# Altium schematic sheet S7CAS-PLEIADES-CARTE-MERE_P06_FPGA3.SCHDOC
size Tabloid; SheetNumber: 8; SheetTotal: 18; Sheet_Name: FPGA3; Size: 11x17
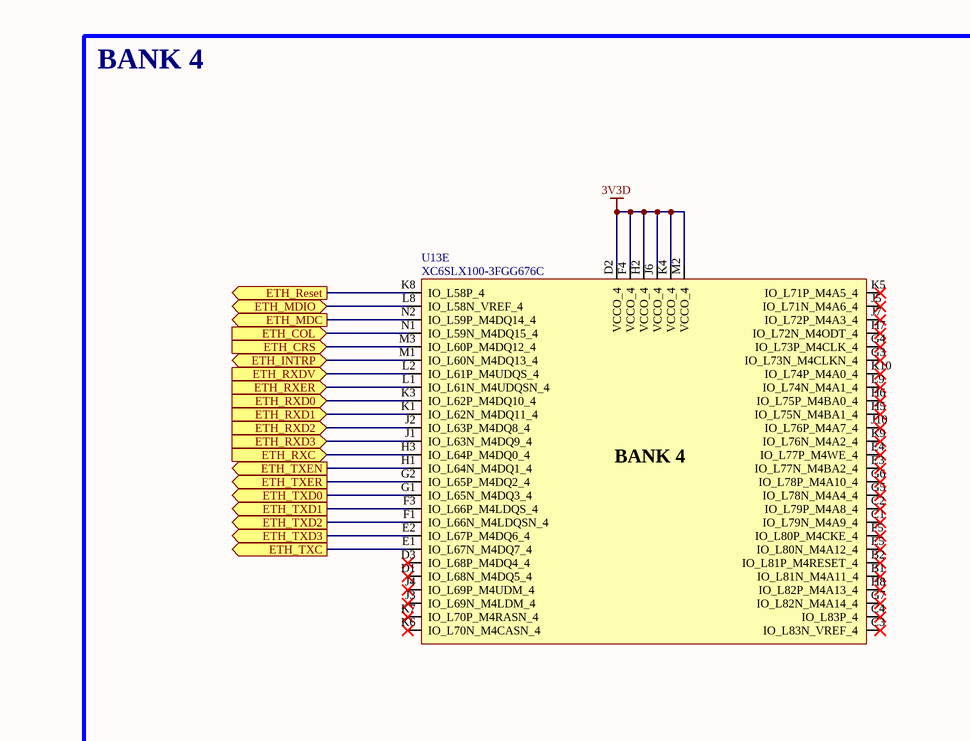
[diagram p0: S7CAS-PLEIADES-CARTE-MERE_P06_FPGA3.SCHDOC, top left]
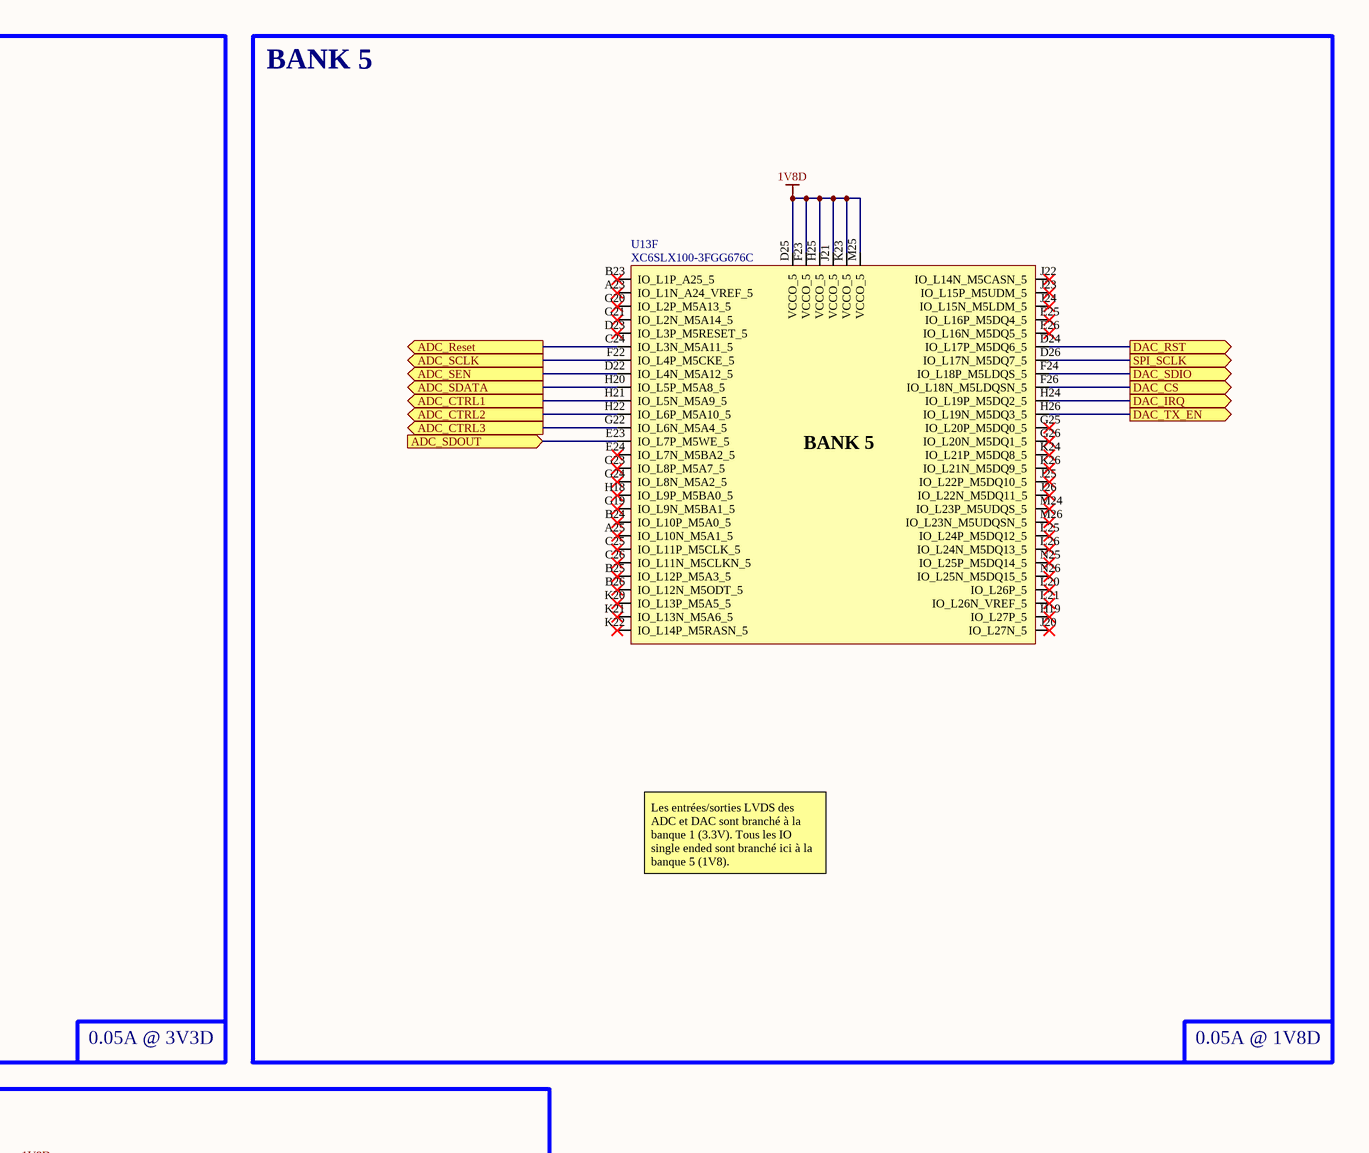
[diagram p1: S7CAS-PLEIADES-CARTE-MERE_P06_FPGA3.SCHDOC, top right]
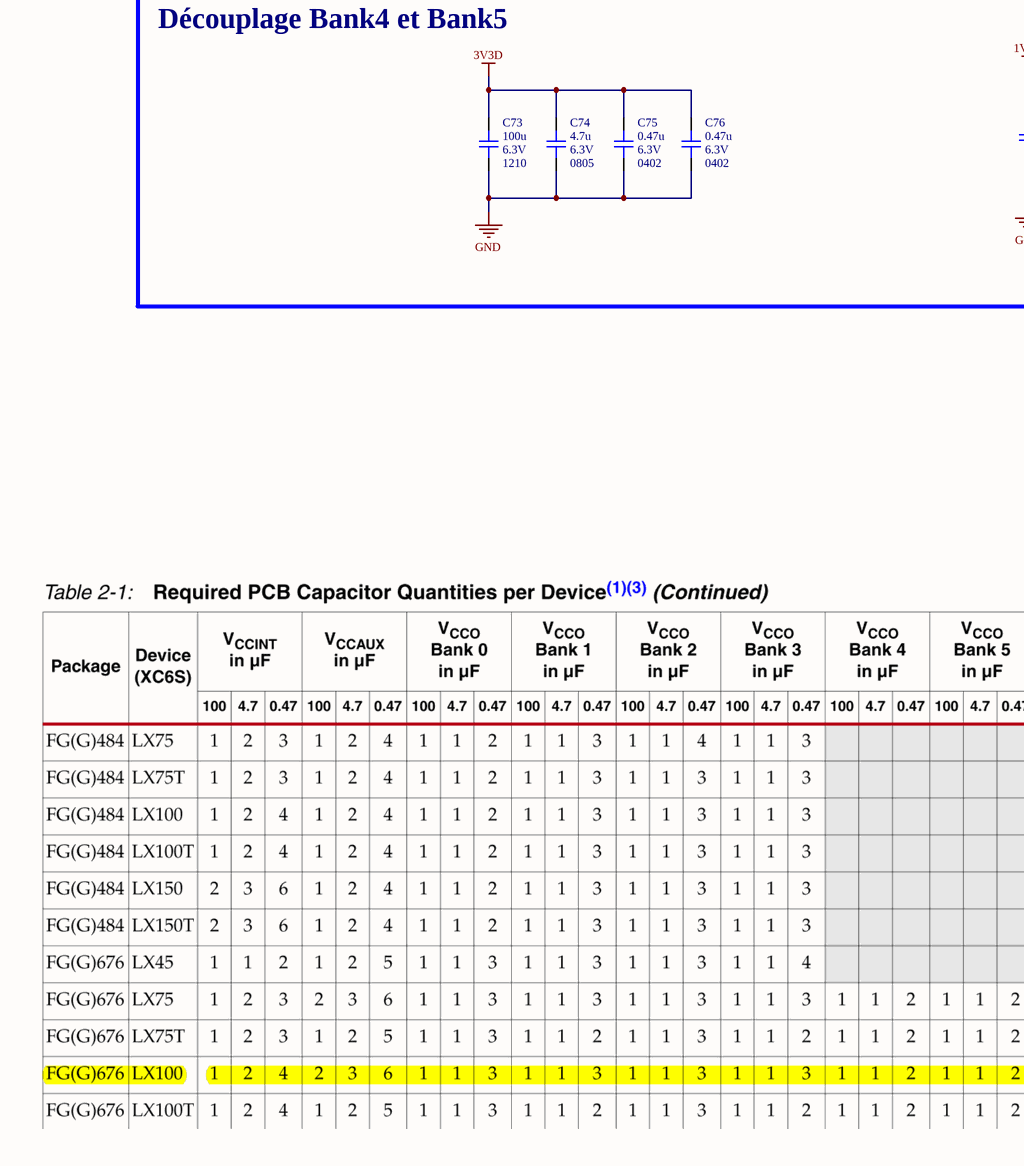
[diagram p2: S7CAS-PLEIADES-CARTE-MERE_P06_FPGA3.SCHDOC, bottom left]
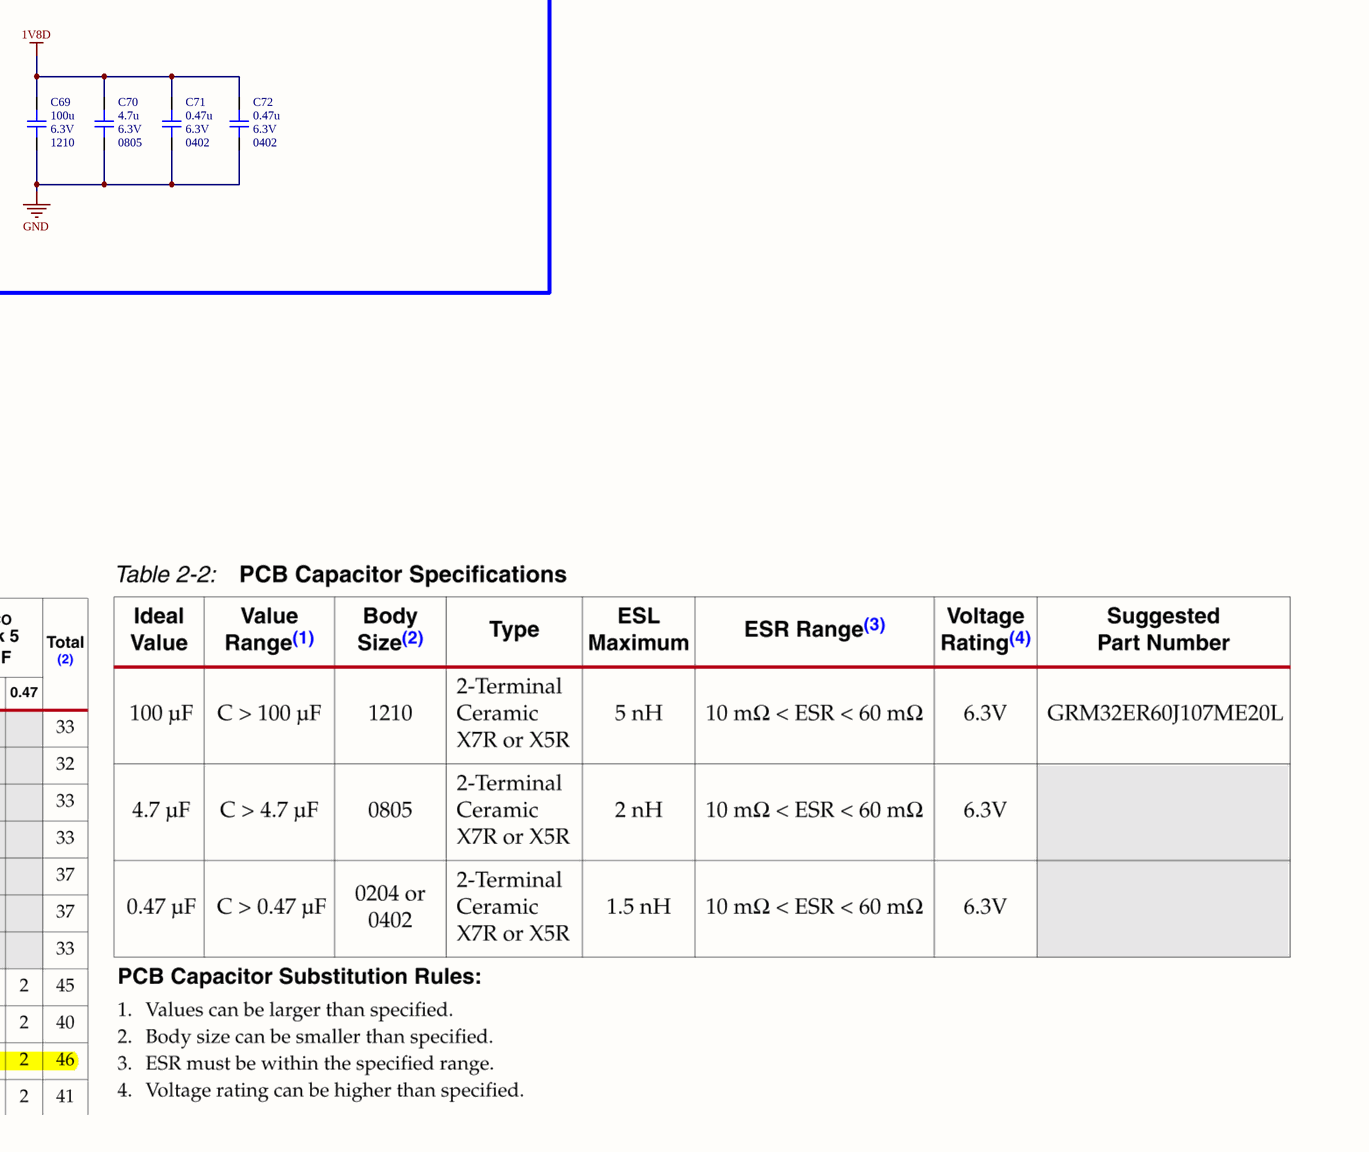
[diagram p3: S7CAS-PLEIADES-CARTE-MERE_P06_FPGA3.SCHDOC, bottom right]

## Parts
C69  value 100u  Voltage: 6.3V  Package: 1210  [CAP_1210]  (hidden comment: CAP - 1210)
C70  value 4.7u  Voltage: 6.3V  Package: 0805  [CAP_0805]  (hidden comment: CAP - 0805)
C71  value 0.47u  Voltage: 6.3V  Package: 0402  [CAP_0402]  (hidden comment: CAP - 0402)
C72  value 0.47u  Voltage: 6.3V  Package: 0402  [CAP_0402]  (hidden comment: CAP - 0402)
C73  value 100u  Voltage: 6.3V  Package: 1210  [CAP_1210]  (hidden comment: CAP - 1210)
C74  value 4.7u  Voltage: 6.3V  Package: 0805  [CAP_0805]  (hidden comment: CAP - 0805)
C75  value 0.47u  Voltage: 6.3V  Package: 0402  [CAP_0402]  (hidden comment: CAP - 0402)
C76  value 0.47u  Voltage: 6.3V  Package: 0402  [CAP_0402]  (hidden comment: CAP - 0402)
U13  XC6SLX100-3FGG676C  [FPGA_XILINX_FGG676]  (parts E,F of 10)

## Blocks framed on the sheet
BANK 4: U13
BANK 5: U13
Découplage Bank4 et Bank5: C69-C76

## Ports
ADC_CTRL1 (out, see S7CAS-PLEIADES-CARTE-MERE_P06_ADC[5A]), ADC_CTRL2 (out, see S7CAS-PLEIADES-CARTE-MERE_P06_ADC[5A]), ADC_CTRL3 (out, see S7CAS-PLEIADES-CARTE-MERE_P06_ADC[5A]), ADC_Reset (out, see S7CAS-PLEIADES-CARTE-MERE_P06_ADC[5A]), ADC_SCLK (out, see S7CAS-PLEIADES-CARTE-MERE_P06_ADC[5A]), ADC_SDATA (out, see S7CAS-PLEIADES-CARTE-MERE_P06_ADC[5A]), ADC_SDOUT (in, see S7CAS-PLEIADES-CARTE-MERE_P06_ADC[6A]), ADC_SEN (out, see S7CAS-PLEIADES-CARTE-MERE_P06_ADC[5A]), DAC_CS (out, see S7CAS-PLEIADES-CARTE-MERE_P06_DAC[5A]), DAC_IRQ (out, see S7CAS-PLEIADES-CARTE-MERE_P06_DAC[5A]), DAC_RST (out, see S7CAS-PLEIADES-CARTE-MERE_P06_DAC[5A]), DAC_SDIO (out, see S7CAS-PLEIADES-CARTE-MERE_P06_DAC[5A]), DAC_TX_EN (out, see S7CAS-PLEIADES-CARTE-MERE_P06_DAC[5B]), ETH_COL (in, see S7CAS-PLEIADES-CARTE-MERE_P06_ETHERNET[2B]), ETH_CRS (in, see S7CAS-PLEIADES-CARTE-MERE_P06_ETHERNET[2B]), ETH_INTRP (bidir, see S7CAS-PLEIADES-CARTE-MERE_P06_ETHERNET[1B]), ETH_MDC (out, see S7CAS-PLEIADES-CARTE-MERE_P06_ETHERNET[2A]), ETH_MDIO (bidir, see S7CAS-PLEIADES-CARTE-MERE_P06_ETHERNET[1A]), ETH_Reset (out, see S7CAS-PLEIADES-CARTE-MERE_P06_ETHERNET[2A]), ETH_RXC (in, see S7CAS-PLEIADES-CARTE-MERE_P06_ETHERNET[2B]), ETH_RXD0 (in, see S7CAS-PLEIADES-CARTE-MERE_P06_ETHERNET[2B]), ETH_RXD1 (in, see S7CAS-PLEIADES-CARTE-MERE_P06_ETHERNET[2B]), ETH_RXD2 (in, see S7CAS-PLEIADES-CARTE-MERE_P06_ETHERNET[2B]), ETH_RXD3 (in, see S7CAS-PLEIADES-CARTE-MERE_P06_ETHERNET[2B]), ETH_RXDV (in, see S7CAS-PLEIADES-CARTE-MERE_P06_ETHERNET[2B]), ETH_RXER (in, see S7CAS-PLEIADES-CARTE-MERE_P06_ETHERNET[2B]), ETH_TXC (out, see S7CAS-PLEIADES-CARTE-MERE_P06_ETHERNET[2B]), ETH_TXD0 (out, see S7CAS-PLEIADES-CARTE-MERE_P06_ETHERNET[2B]), ETH_TXD1 (out, see S7CAS-PLEIADES-CARTE-MERE_P06_ETHERNET[2B]), ETH_TXD2 (out, see S7CAS-PLEIADES-CARTE-MERE_P06_ETHERNET[2B]), ETH_TXD3 (out, see S7CAS-PLEIADES-CARTE-MERE_P06_ETHERNET[2B]), ETH_TXEN (out, see S7CAS-PLEIADES-CARTE-MERE_P06_ETHERNET[2B]), ETH_TXER (out, see S7CAS-PLEIADES-CARTE-MERE_P06_ETHERNET[2B]), SPI_SCLK (out, see S7CAS-PLEIADES-CARTE-MERE_P06_DAC[5A])

## Nets
1V8D: C69.2 C70.2 C71.2 C72.2 U13.D25(VCCO_5) U13.F23(VCCO_5) U13.H25(VCCO_5) U13.J21(VCCO_5) U13.K23(VCCO_5) U13.M25(VCCO_5)
3V3D: C73.2 C74.2 C75.2 C76.2 U13.D2(VCCO_4) U13.F4(VCCO_4) U13.H2(VCCO_4) U13.J6(VCCO_4) U13.K4(VCCO_4) U13.M2(VCCO_4)
GND: C69.1 C70.1 C71.1 C72.1 C73.1 C74.1 C75.1 C76.1
ADC_CTRL1: U13.H21(IO_L5N_M5A9_5) ; port ADC_CTRL1
ADC_CTRL2: U13.H22(IO_L6P_M5A10_5) ; port ADC_CTRL2
ADC_CTRL3: U13.G22(IO_L6N_M5A4_5) ; port ADC_CTRL3
ADC_Reset: U13.C24(IO_L3N_M5A11_5) ; port ADC_Reset
ADC_SCLK: U13.F22(IO_L4P_M5CKE_5) ; port ADC_SCLK
ADC_SDATA: U13.H20(IO_L5P_M5A8_5) ; port ADC_SDATA
ADC_SDOUT: U13.E23(IO_L7P_M5WE_5) ; port ADC_SDOUT
ADC_SEN: U13.D22(IO_L4N_M5A12_5) ; port ADC_SEN
DAC_CS: U13.F26(IO_L18N_M5LDQSN_5) ; port DAC_CS
DAC_IRQ: U13.H24(IO_L19P_M5DQ2_5) ; port DAC_IRQ
DAC_RST: U13.D24(IO_L17P_M5DQ6_5) ; port DAC_RST
DAC_SDIO: U13.F24(IO_L18P_M5LDQS_5) ; port DAC_SDIO
DAC_TX_EN: U13.H26(IO_L19N_M5DQ3_5) ; port DAC_TX_EN
ETH_COL: U13.N1(IO_L59N_M4DQ15_4) ; port ETH_COL
ETH_CRS: U13.M3(IO_L60P_M4DQ12_4) ; port ETH_CRS
ETH_INTRP: U13.M1(IO_L60N_M4DQ13_4) ; port ETH_INTRP
ETH_MDC: U13.N2(IO_L59P_M4DQ14_4) ; port ETH_MDC
ETH_MDIO: U13.L8(IO_L58N_VREF_4) ; port ETH_MDIO
ETH_Reset: U13.K8(IO_L58P_4) ; port ETH_Reset
ETH_RXC: U13.H3(IO_L64P_M4DQ0_4) ; port ETH_RXC
ETH_RXD0: U13.K3(IO_L62P_M4DQ10_4) ; port ETH_RXD0
ETH_RXD1: U13.K1(IO_L62N_M4DQ11_4) ; port ETH_RXD1
ETH_RXD2: U13.J2(IO_L63P_M4DQ8_4) ; port ETH_RXD2
ETH_RXD3: U13.J1(IO_L63N_M4DQ9_4) ; port ETH_RXD3
ETH_RXDV: U13.L2(IO_L61P_M4UDQS_4) ; port ETH_RXDV
ETH_RXER: U13.L1(IO_L61N_M4UDQSN_4) ; port ETH_RXER
ETH_TXC: U13.E1(IO_L67N_M4DQ7_4) ; port ETH_TXC
ETH_TXD0: U13.G1(IO_L65N_M4DQ3_4) ; port ETH_TXD0
ETH_TXD1: U13.F3(IO_L66P_M4LDQS_4) ; port ETH_TXD1
ETH_TXD2: U13.F1(IO_L66N_M4LDQSN_4) ; port ETH_TXD2
ETH_TXD3: U13.E2(IO_L67P_M4DQ6_4) ; port ETH_TXD3
ETH_TXEN: U13.H1(IO_L64N_M4DQ1_4) ; port ETH_TXEN
ETH_TXER: U13.G2(IO_L65P_M4DQ2_4) ; port ETH_TXER
SPI_SCLK: U13.D26(IO_L17N_M5DQ7_5) ; port SPI_SCLK

Not connected (* = marked no-connect by the designer): U13 A23(IO_L1N_A24_VREF_5)* A25(IO_L10N_M5A1_5)* B1(IO_L81N_M4A11_4)* B2(IO_L81P_M4RESET_4)* B23(IO_L1P_A25_5)* B24(IO_L10P_M5A0_5)* B25(IO_L12P_M5A3_5)* B26(IO_L12N_M5ODT_5)* C1(IO_L79N_M4A9_4)* C2(IO_L79P_M4A8_4)* C3(IO_L83N_VREF_4)* C4(IO_L83P_4)* C25(IO_L11P_M5CLK_5)* C26(IO_L11N_M5CLKN_5)* D1(IO_L68N_M4DQ5_4)* D3(IO_L68P_M4DQ4_4)* D23(IO_L3P_M5RESET_5)* E3(IO_L77N_M4BA2_4)* E4(IO_L77P_M4WE_4)* E5(IO_L80N_M4A12_4)* E24(IO_L7N_M5BA2_5)* E25(IO_L16P_M5DQ4_5)* E26(IO_L16N_M5DQ5_5)* F5(IO_L80P_M4CKE_4)* G3(IO_L73N_M4CLKN_4)* G4(IO_L73P_M4CLK_4)* G5(IO_L78N_M4A4_4)* G6(IO_L78P_M4A10_4)* G7(IO_L82N_M4A14_4)* G19(IO_L9N_M5BA1_5)* G20(IO_L2P_M5A13_5)* G21(IO_L2N_M5A14_5)* G23(IO_L8P_M5A7_5)* G24(IO_L8N_M5A2_5)* G25(IO_L20P_M5DQ0_5)* G26(IO_L20N_M5DQ1_5)* H5(IO_L75N_M4BA1_4)* H6(IO_L75P_M4BA0_4)* H7(IO_L72N_M4ODT_4)* H8(IO_L82P_M4A13_4)* H18(IO_L9P_M5BA0_5)* H19(IO_L27P_5)* J3(IO_L69N_M4LDM_4)* J4(IO_L69P_M4UDM_4)* J5(IO_L71N_M4A6_4)* J7(IO_L72P_M4A3_4)* J10(IO_L76P_M4A7_4)* J20(IO_L27N_5)* J22(IO_L14N_M5CASN_5)* J23(IO_L15P_M5UDM_5)* J24(IO_L15N_M5LDM_5)* J25(IO_L22P_M5DQ10_5)* J26(IO_L22N_M5DQ11_5)* K5(IO_L71P_M4A5_4)* K6(IO_L70N_M4CASN_4)* K7(IO_L70P_M4RASN_4)* K9(IO_L76N_M4A2_4)* K10(IO_L74P_M4A0_4)* K20(IO_L13P_M5A5_5)* K21(IO_L13N_M5A6_5)* K22(IO_L14P_M5RASN_5)* K24(IO_L21P_M5DQ8_5)* K26(IO_L21N_M5DQ9_5)* L9(IO_L74N_M4A1_4)* L20(IO_L26P_5)* L21(IO_L26N_VREF_5)* L25(IO_L24P_M5DQ12_5)* L26(IO_L24N_M5DQ13_5)* M24(IO_L23P_M5UDQS_5)* M26(IO_L23N_M5UDQSN_5)* N25(IO_L25P_M5DQ14_5)* N26(IO_L25N_M5DQ15_5)*

## Notes on the sheet
- Les entrées/sorties LVDS des ADC et DAC sont branché à la banque 1 (3.3V). Tous les IO single ended sont branché ici à la banque 5 (1V8).
- 0.05A @ 3V3D
- 0.05A @ 1V8D
- Sheet Name
- Project Title
- Global Project
- Size
- Group
- Revision
- Date
- Sheet
- of
- Filename
- Designers
- (in symbol FPGA_XC6SLX100-3FGG676C, part E) BANK 4
- (in symbol FPGA_XC6SLX100-3FGG676C, part F) BANK 5

## Library data of the parts
C69 C73 = CAP - 1210: Precision: 10%; Current: *; CreatedBy: Jonathan Bouchard; Power: *
C70 C74 = CAP - 0805: Precision: 10%; Current: *; CreatedBy: Jonathan Bouchard; Power: *
C71 C72 C75 C76 = CAP - 0402: Precision: 10%; Current: *; CreatedBy: Jonathan Bouchard; Power: *
U13 = FPGA_XC6SLX100-3FGG676C: FPGA - XILINX SPARTAN 6 480 I/O - BGA-676; Voltage: 1.14 V ~ 1.26 V; Current: *; Power: *; Mfg: Xilinx; Mfg Part Number: XC6SLX100-3FGG676C; HelpURL: https://www.xilinx.com/support/documentation/data_sheets/ds162.pdf; CreatedBy: Jonathan Bouchard; Temperature: 0°C ~ 85°C (TJ); Value: *; Precision: *; Package: BGA-676; Supplier 1: Digikey; Supplier Part Number 1: 122-1760-ND